# EasyEDA schematic SCH_全分立LM324_2022-09-28.json
TITLE: LM324; REV: 1.0; Date: 2022-07-22; Sheet: 1/1; Drawn By: BH2VGM; Company: NEU-ISE
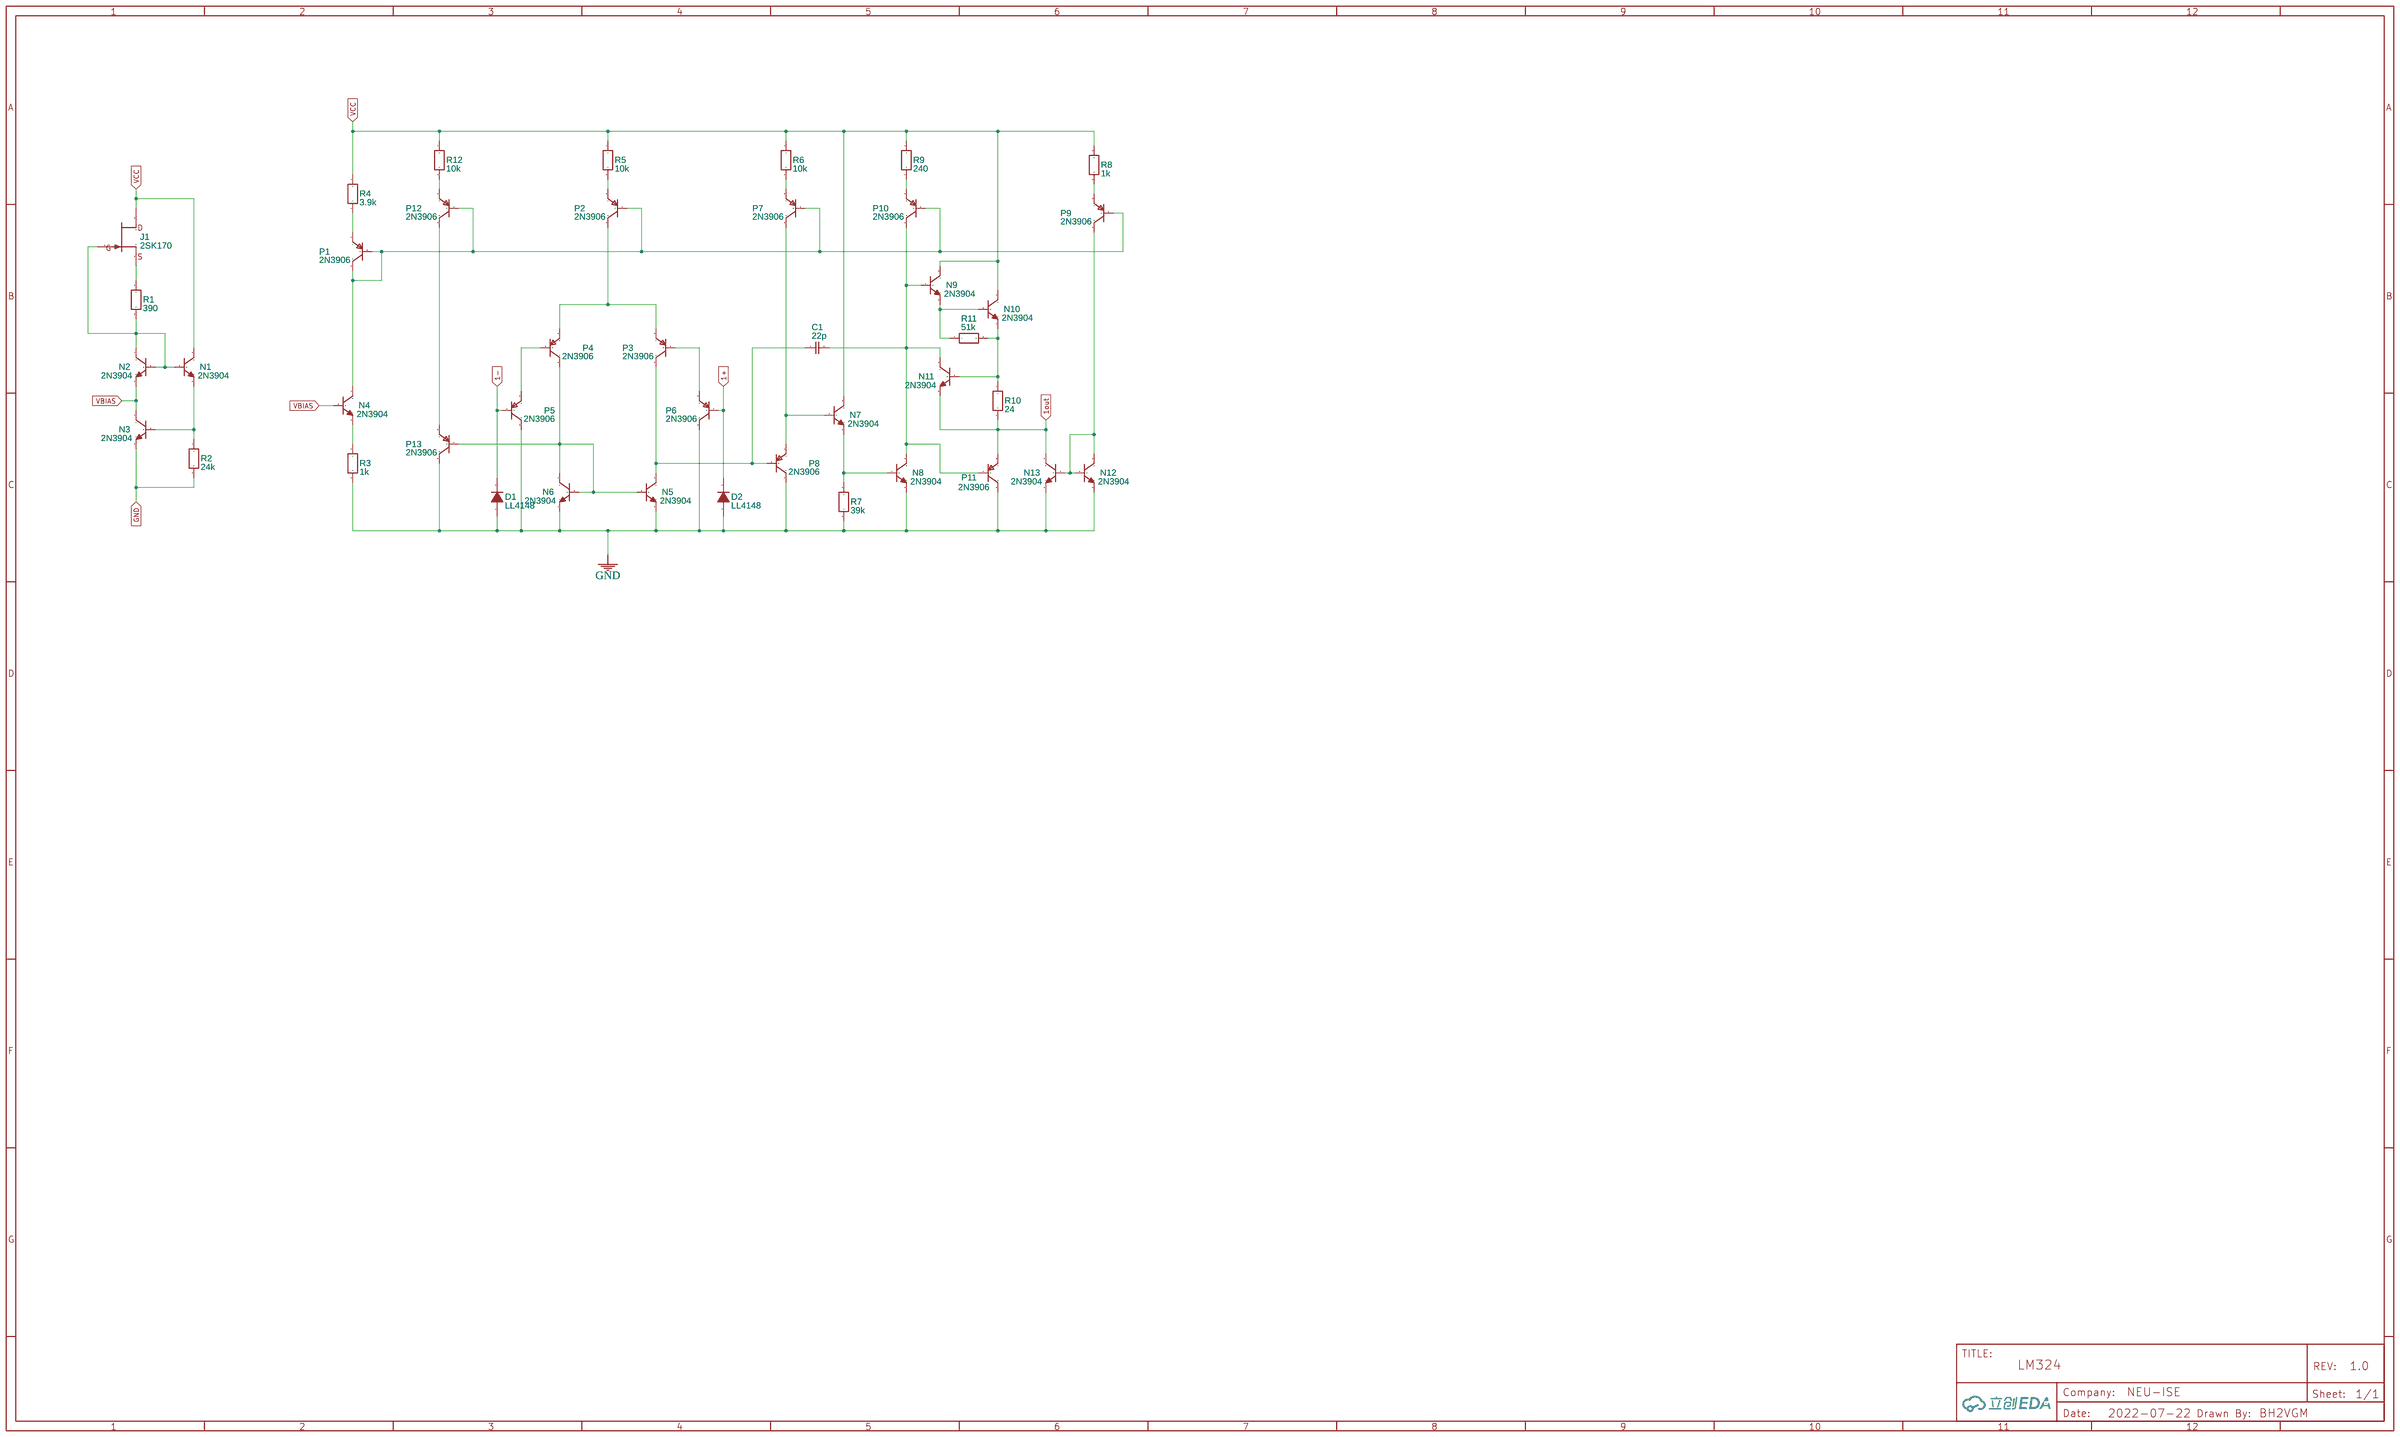
[diagram p0: schematic sheet]

## Parts
C1  22p  [C0805]
D1  LL4148  [SOD-80]
D2  LL4148  [SOD-80]
J1  2SK170  [2SK170]
N1  2N3904  [TO-92-3]
N2  2N3904  [TO-92-3]
N3  2N3904  [TO-92-3]
N4  2N3904  [TO-92-3]
N5  2N3904  [TO-92-3]
N6  2N3904  [TO-92-3]
N7  2N3904  [TO-92-3]
N8  2N3904  [TO-92-3]
N9  2N3904  [TO-92-3]
N10  2N3904  [TO-92-3]
N11  2N3904  [TO-92-3]
N12  2N3904  [TO-92-3]
N13  2N3904  [TO-92-3]
P1  2N3906  [TO-92-3]
P2  2N3906  [TO-92-3]
P3  2N3906  [TO-92-3]
P4  2N3906  [TO-92-3]
P5  2N3906  [TO-92-3]
P6  2N3906  [TO-92-3]
P7  2N3906  [TO-92-3]
P8  2N3906  [TO-92-3]
P9  2N3906  [TO-92-3]
P10  2N3906  [TO-92-3]
P11  2N3906  [TO-92-3]
P12  2N3906  [TO-92-3]
P13  2N3906  [TO-92-3]
R1  390  [R0805]
R2  24k  [R0805]
R3  1k  [R0805]
R4  3.9k  [R0805]
R5  10k  [R0805]
R6  10k  [R0805]
R7  39k  [R0805]
R8  1k  [R0805]
R9  240  [R0805]
R10  24  [R0805]
R11  51k  [R0805]
R12  10k  [R0805]

## Library data of the parts
C1 = 独石电容 5.08mm: Contributor: king13478509115
D1 D2 = LL4148: Supplier: LCSC; Manufacturer: VISHAY; Manufacturer Part: LL4148-GS08; Supplier Part: C68883; JLCPCB Part Class: Extended Part; Contributor: king13478509115
J1 = 2SK170: Contributor: king13478509115
N1-N13 = 2N3904: Supplier: LCSC; Manufacturer: SEMTECH; Supplier Part: C118538; JLCPCB Part Class: Extended Part; Contributor: king13478509115
P1-P13 = 2N3906: Supplier: LCSC; Manufacturer: CJ; Supplier Part: C9809; JLCPCB Part Class: Extended Part; Contributor: king13478509115
R1-R12 = 1/4W电阻: Contributor: king13478509115

## Nets
GND: D1.2(A) D2.2(A) N3.e(E) N5.e(E) N6.e(E) N8.e(E) N12.e(E) N13.e(E) P5.c(C) P6.c(C) P8.c(C) P11.c(C) P13.c(C) R2.2 R3.2 R7.2
VCC: J1.3(D) N1.c(C) N7.c(C) N9.c(C) N10.c(C) R4.1 R5.1 R6.1 R8.1 R9.1 R12.1
1+: D2.1(C) P6.b(B)
1-: D1.1(C) P5.b(B)
1out: N11.e(E) N13.c(C) P11.e(E) R10.2
VBIAS: N2.e(E) N3.c(C) N4.b(B)
Net-(C1-1): C1.1 N5.c(C) P3.c(C) P8.b(B)
Net-(C1-2): C1.2 N8.c(C) N9.b(B) N11.c(C) P10.c(C) P11.b(B)
Net-(J1-1): J1.1(S) R1.1
Net-(J1-2): J1.2(G) N1.b(B) N2.b(B) N2.c(C) R1.2
Net-(N1-e): N1.e(E) N3.b(B) R2.1
Net-(N4-c): N4.c(C) P1.b(B) P1.c(C) P2.b(B) P7.b(B) P9.b(B) P10.b(B) P12.b(B)
Net-(N4-e): N4.e(E) R3.1
Net-(N5-b): N5.b(B) N6.b(B) N6.c(C) P4.c(C) P13.b(B)
Net-(N7-b): N7.b(B) P7.c(C) P8.e(E)
Net-(N7-e): N7.e(E) N8.b(B) R7.1
Net-(N9-e): N9.e(E) N10.b(B) R11.1
Net-(N10-e): N10.e(E) N11.b(B) R10.1 R11.2
Net-(N12-b): N12.b(B) N12.c(C) N13.b(B) P9.c(C)
Net-(P1-e): P1.e(E) R4.2
Net-(P2-c): P2.c(C) P3.e(E) P4.e(E)
Net-(P2-e): P2.e(E) R5.2
Net-(P3-b): P3.b(B) P6.e(E)
Net-(P4-b): P4.b(B) P5.e(E)
Net-(P7-e): P7.e(E) R6.2
Net-(P9-e): P9.e(E) R8.2
Net-(P10-e): P10.e(E) R9.2
Net-(P12-c): P12.c(C) P13.e(E)
Net-(P12-e): P12.e(E) R12.2
